# EAGLE design AutoLevel Module V1.1 (EAGLE 8.2.2)
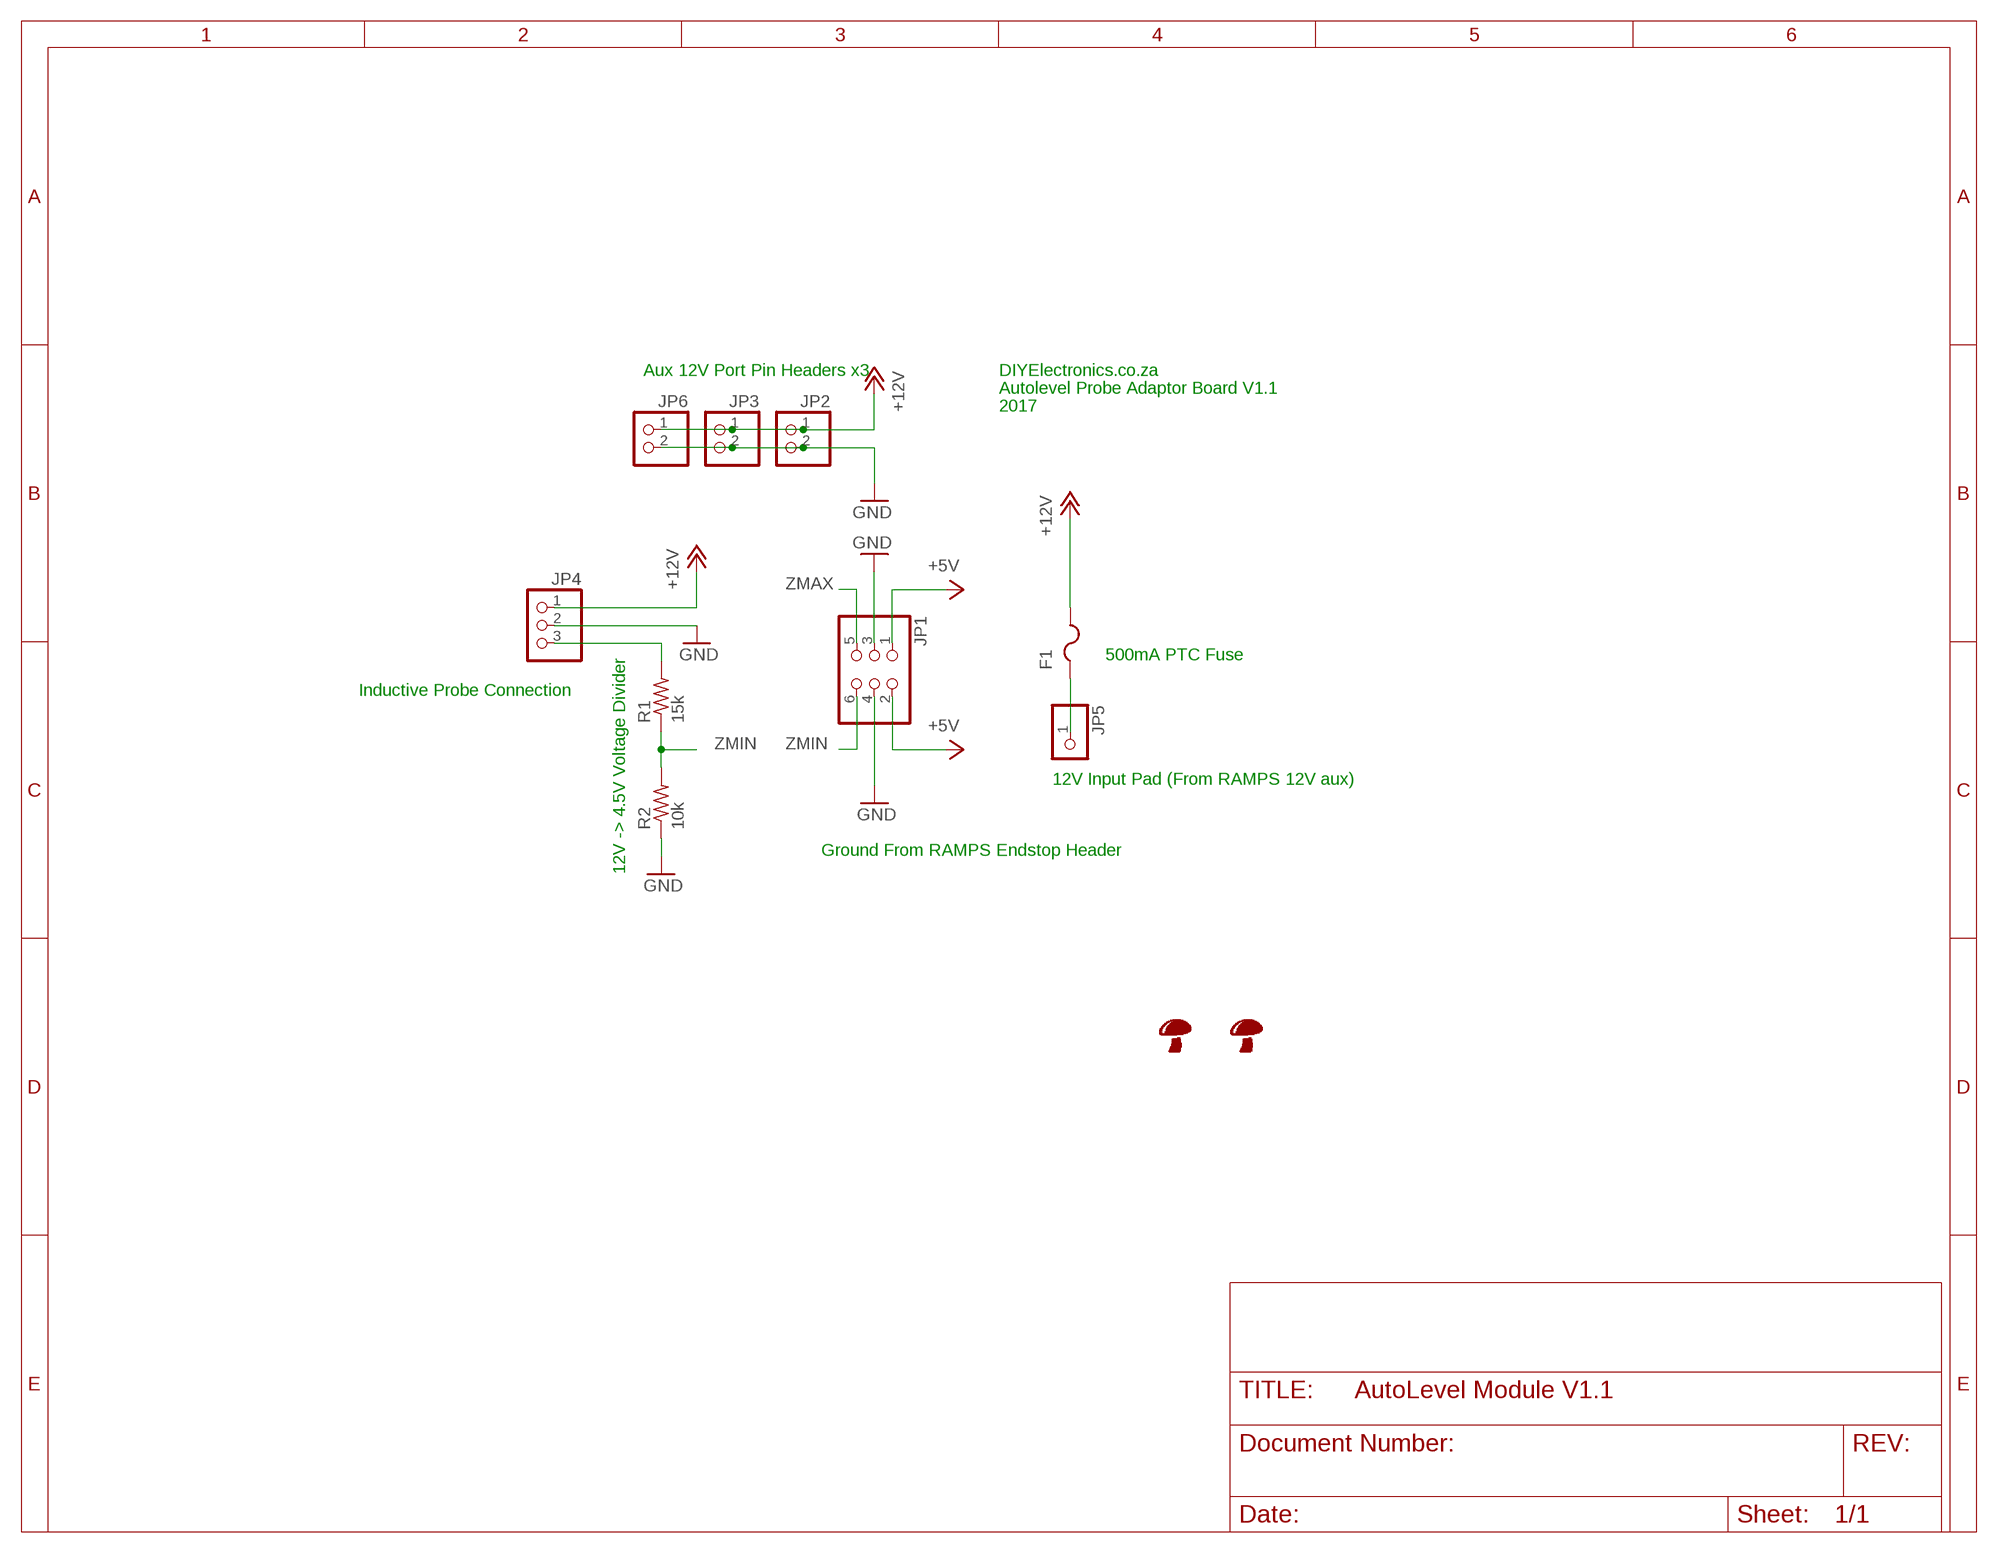
[diagram p0: schematic, sheet 1]

## Parts
F1  PTCFUSE-1812  [1812]
JP1  PINHD-2X3  [2X03]
JP2  PINHD-1X2  [1X02]
JP3  PINHD-1X2  [1X02]
JP4  PINHD-1X3  [1X03]
JP5  PINHD-1X1  [1X01]
JP6  PINHD-1X2  [1X02]
R1  15k  R-US_R0805  [R0805]
R2  10k  R-US_R0805  [R0805]
U$1  SHROOM5MM  [SHROOM]
U$2  SHROOMBOTTOMSILK  [SHROOM_BS]

## Nets
+5V: JP1.1 JP1.2
+12V: F1.2 JP2.1 JP3.1 JP4.1 JP6.1
GND: JP1.3 JP1.4 JP2.2 JP3.2 JP4.2 JP6.2 R2.1
N$1: F1.1 JP5.1
N$2: JP4.3 R1.2
ZMAX: JP1.5
ZMIN: JP1.6 R1.1 R2.2

## Notes on the sheet
- Aux 12V Port Pin Headers x3 | DIYElectronics.co.za
- Autolevel Probe Adaptor Board V1.1
- 2017
- 500mA PTC Fuse
- Inductive Probe Connection
- 12V Input Pad (From RAMPS 12V aux)
- Ground From RAMPS Endstop Header
- 12V -> 4.5V Voltage Divider

## Library data of the parts
F1 = adafruit:PTCFUSE: PTC fuses, resettable thermistors
JP1 = pinhead:PINHD-2X3: PIN HEADER
JP2 JP3 JP6 = pinhead:PINHD-1X2: PIN HEADER
JP4 = pinhead:PINHD-1X3: PIN HEADER
JP5 = pinhead:PINHD-1X1: PIN HEADER
R1 R2 = resistor:R-US_: RESISTOR, American symbol
U$1 U$2 = RobThePyro:SHROOM

## Board
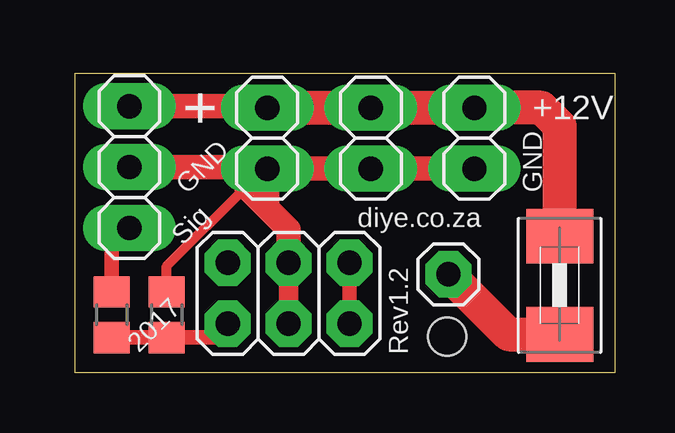
[diagram p1: board, top side]
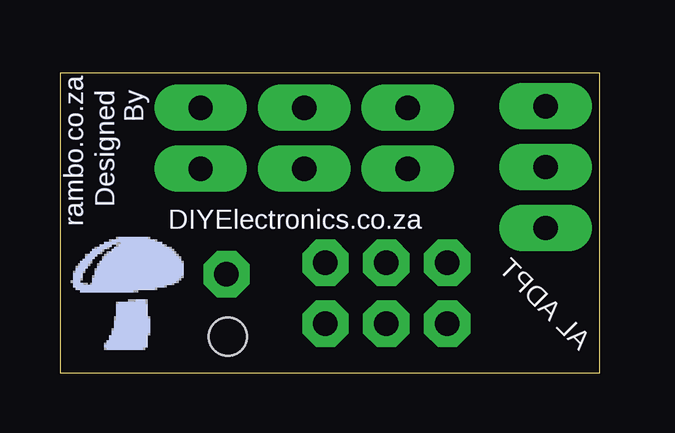
[diagram p2: board, bottom side, seen from below]

Size 22.5 x 12.5 mm. Coordinates in mm from the lower left corner, seen from the top.
Outline: 0,0 0,12.5 22.5,12.5 22.5,0 0,0
Copper layers (1*16): Top 0.035mm / dielectric 1.5mm / Bottom 0.035mm
Design rules "default *": minimum track width 10mil, minimum drill 24mil, track to track 8mil, track to pad 8mil, pad to pad 8mil, via to via 8mil, smd to smd 8mil, copper to edge 40mil, drill to drill 8mil, minimum pad ring 18mil, minimum via ring 8mil, stop-mask expansion 4mil, vias tented up to drill 0mil, thermal gap 10mil
Holes 1.6 mm at 15.5,1.5

### Footprints (pad centres in the part's own frame; a part is rotated, then mirrored left to right if it is on the bottom)
1812 = smd 2.286 x 2.794: 1 -2.046,0; 2 2.046,0
2X03 = drill 1.016 octagon: 1 -2.54,-1.27; 2 -2.54,1.27; 3 0,-1.27; 4 0,1.27; 5 2.54,-1.27; 6 2.54,1.27
1X02 = drill 1.016 long: 1 -1.27,0; 2 1.27,0
1X03 = drill 1.016 long: 1 -2.54,0; 2 0,0; 3 2.54,0
1X01 = drill 1.016 octagon: 1 0,0
R0805 = smd 1.3 x 1.5: 1 -0.95,0; 2 0.95,0

### Placement (x,y rotation side)
F1  20.19,3.64 90 top
JP1  8.89,3.31 180 top
JP2  8,9.78 270 top
JP3  12.32,9.78 270 top
JP4  2.25,8.57 270 top
JP5  15.55,4.1 0 top
JP6  16.64,9.78 270 top
R1  1.52,2.41 90 top
R2  3.81,2.41 270 top
U$1  22,1 0 bottom
U$2  22,1 0 bottom

### Tracks (layer width: path | path; a pad name or v marks a point on that pad's centre or on a via)
+5V
  Top 0.61: JP1.1 JP1.2
+12V
  Top 0.61: 7.94,11.11 JP2.1
  Top 1.016: JP4.1 7.94,11.11
  Top 1.422: JP2.1 JP3.1 JP6.1 19.43,11.05 20.19,10.29 F1.2
GND
  Top 0.406: R2.1 3.81,4.45 7.11,7.75
  Top 0.813: 6.29,8.57 7.11,7.75 | JP1.3 JP1.4 | 8,6.99 7.94,6.92
  Top 1.016: JP4.2 6.29,8.57 | 7.11,7.75 7.94,6.92 8.89,5.97 JP1.3 | JP6.2 JP3.2 JP2.2 8,6.99
N$1
  Top 1.422: JP5.1 18.06,1.6 F1.1
N$2
  Top 0.61: R1.2 1.52,5.3 JP4.3
ZMIN
  Top 0.61: R1.1 R2.2 5.77,1.46 JP1.6

### Text on the board
Bottom: Designed / By | rambo.co.za | DIYElectronics.co.za
tNames: +12V | + | GND | GND | diye.co.za | Sig | 2017 | Rev1.2
bNames: Designed / By | rambo.co.za | DIYElectronics.co.za | AL ADPT